# EAGLE schematic ATTAMI-IR_shield V2 (EAGLE 7.3.0)
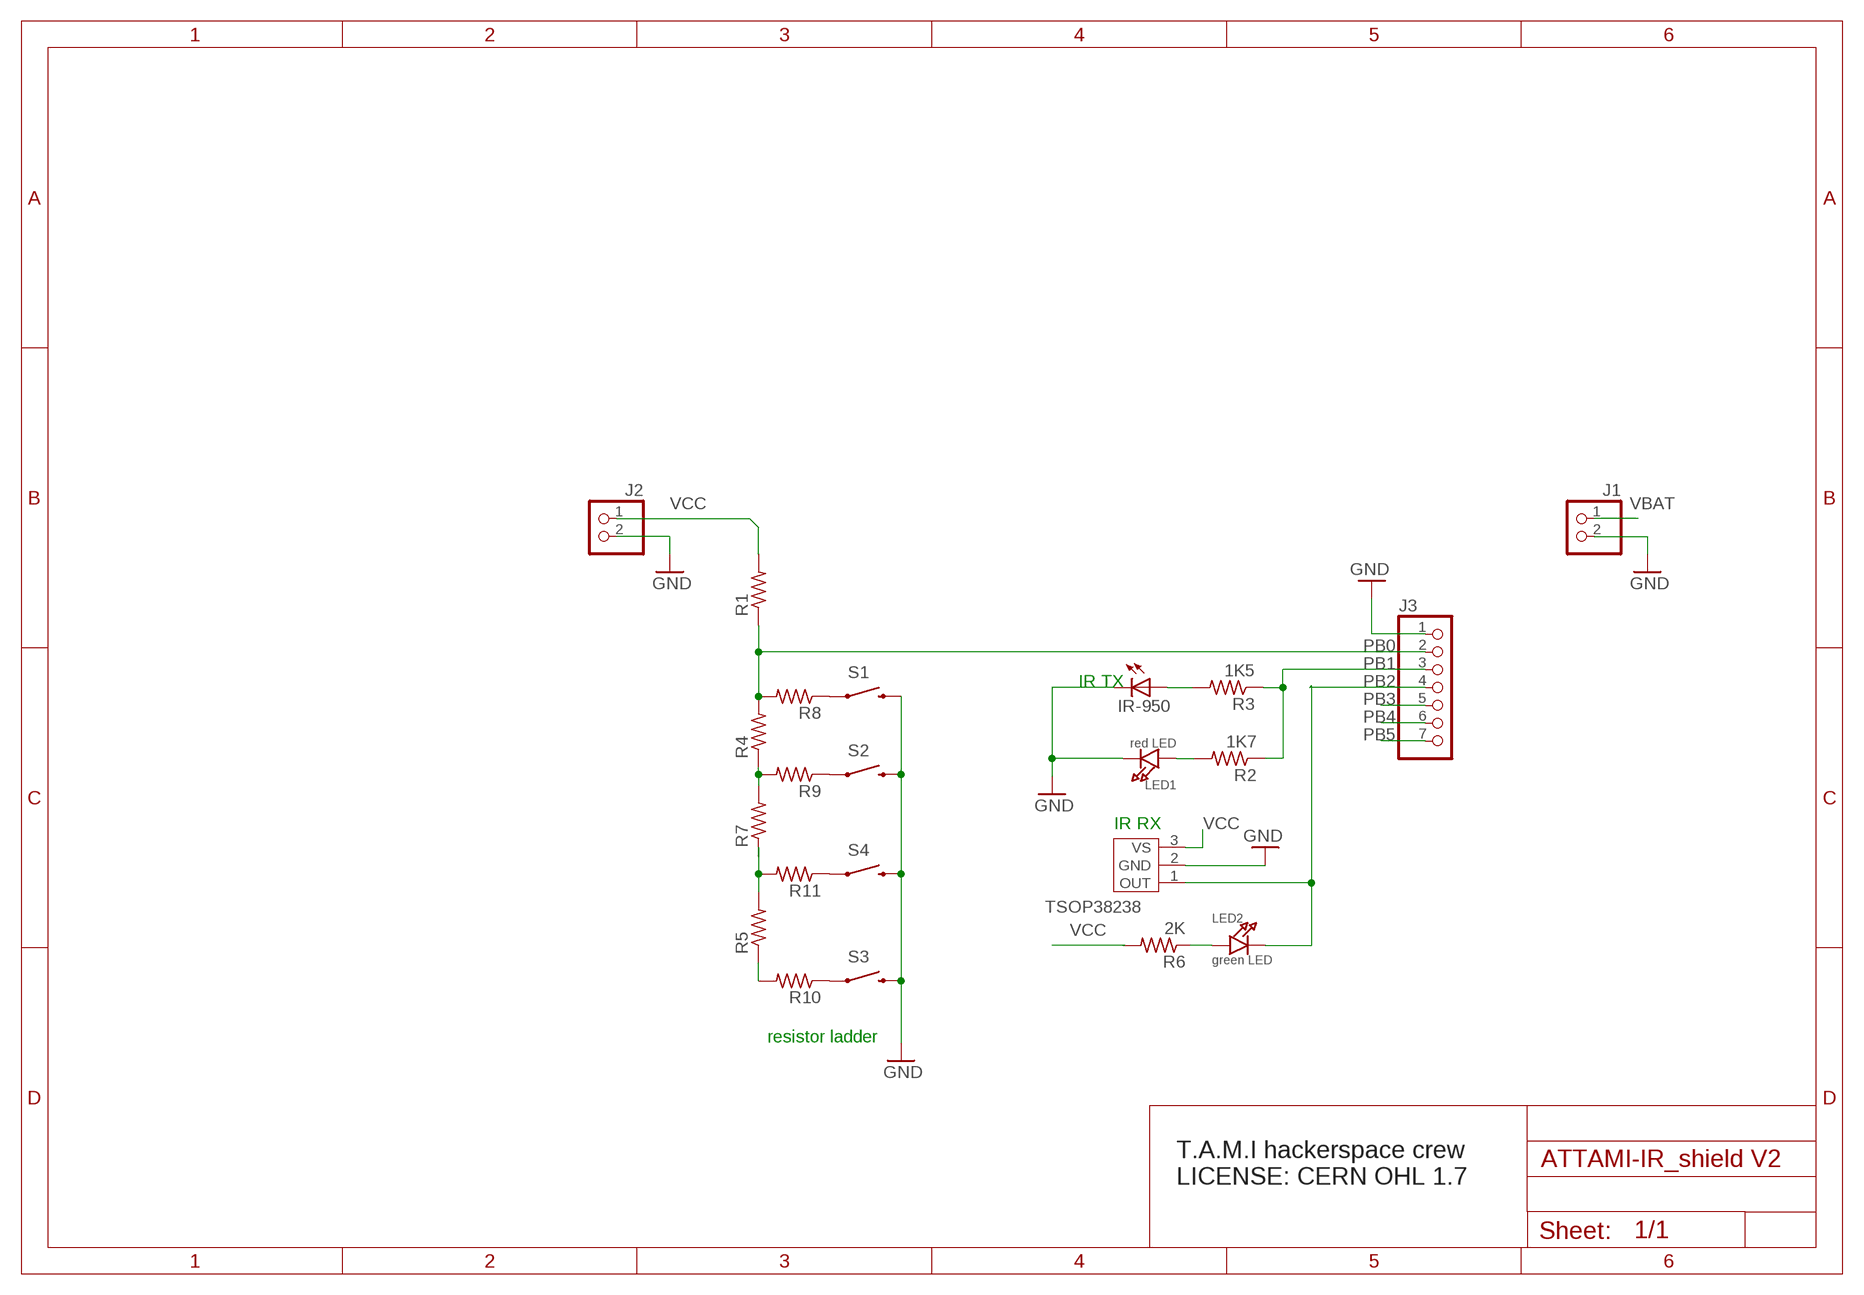
[diagram p0: schematic, sheet 1]

## Parts
IR-950  LEDIRL80A  [IRL80A]
J1  HEADER-1X2ROUND  [1X02_ROUND]
J2  HEADER-1X2ROUND  [1X02_ROUND]
J3  HEADER-1X7ROUND  [1X07_ROUND]
LED1  red LED  LED0805  [CHIPLED_0805]
LED2  green LED  LED0805  [CHIPLED_0805]
R1  R-US_M0805  [M0805]
R2  1K7  R-US_M0805  [M0805]
R3  1K5  R-US_M0805  [M0805]
R4  R-US_M0805  [M0805]
R5  R-US_M0805  [M0805]
R6  2K  R-US_M0805  [M0805]
R7  R-US_M0805  [M0805]
R8  R-US_M0805  [M0805]
R9  R-US_M0805  [M0805]
R10  R-US_M0805  [M0805]
R11  R-US_M0805  [M0805]
S1  SWITCH-MOMENTARY-2-SMD-1101NE  [TACTILE-SWITCH-1101NE]
S2  SWITCH-MOMENTARY-2-SMD-1101NE  [TACTILE-SWITCH-1101NE]
S3  SWITCH-MOMENTARY-2-SMD-1101NE  [TACTILE-SWITCH-1101NE]
S4  SWITCH-MOMENTARY-2-SMD-1101NE  [TACTILE-SWITCH-1101NE]
TSOP38238  TSOP382  [3P-2.54-4.8X5X6.95H]

## Nets
GND: IR-950.K(C) J1.2 J2.2 J3.1 LED1.C S1.P$2 S2.P$2 S3.P$2 S4.P$2 TSOP38238.2(GND)
N$1: R9.1 S2.P$1
N$3: R8.1 S1.P$1
N$4: R10.1 S3.P$1
N$5: LED1.A R2.2
N$6: R5.2 R11.2
N$7: R4.1 R7.2 R9.2
N$8: R5.1 R10.2
N$10: IR-950.A R3.2
N$13: R11.1 S4.P$1
N$14: LED2.A
PB0: J3.2 R1.1 R4.2 R8.2
PB1: J3.3 R2.1 R3.1
PB2: J3.4 LED2.C TSOP38238.1(OUT)
PB3: J3.5
PB4: J3.6
PB5: J3.7
VBAT: J1.1
VCC: J2.1 R1.2 TSOP38238.3(VS)
Unconnected: R6.1 R6.2 R7.1

## Notes on the sheet
- IR TX
- IR RX
- resistor ladder
- T.A.M.I hackerspace crew 
  LICENSE: CERN OHL 1.7

## Library data of the parts
IR-950 = adafruit:LED: LED
J1 J2 = microbuilder:HEADER-1X2: PIN HEADER
J3 = microbuilder:HEADER-1X7: PIN HEADER
LED1 LED2 = microbuilder:LED: LED
R1-R11 = adafruit:R-US_: RESISTOR, American symbol
S1-S4 = SparkFun-Electromechanical:SWITCH-MOMENTARY-2: Various NO switches- pushbuttons, reed, etc
TSOP38238 = IC:TSOP382: IR Receiver Modules for Remote Control Systems

## Net classes
0 default: width 0.203 mm
1 vcc: width 0.254 mm